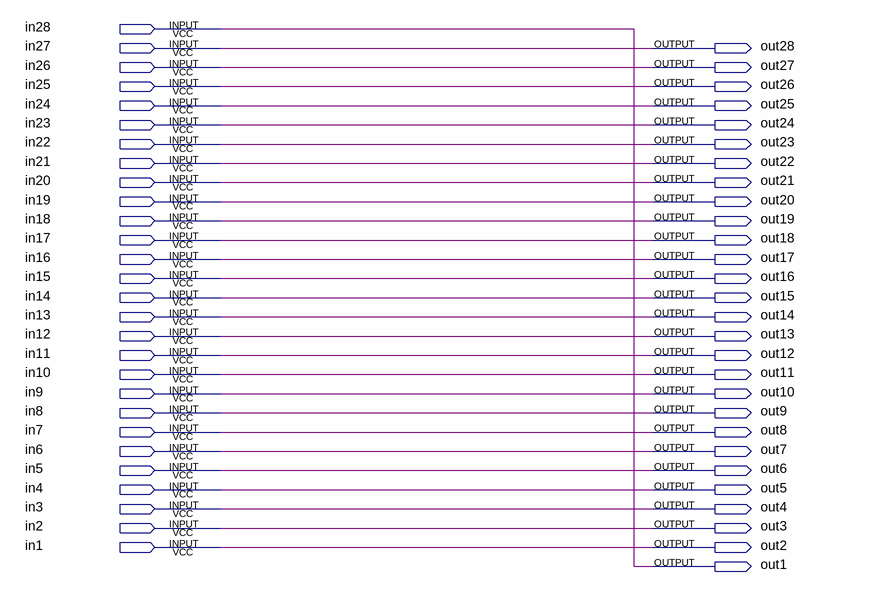
[diagram p0: schematic sheet]
// Quartus schematic lshift1.bdf as structural Verilog: 0 symbols, 56 pins
module lshift1 (
  input  in28,
  input  in27,
  input  in26,
  input  in25,
  input  in24,
  input  in23,
  input  in22,
  input  in21,
  input  in20,
  input  in19,
  input  in18,
  input  in17,
  input  in16,
  input  in15,
  input  in14,
  input  in13,
  input  in12,
  input  in11,
  input  in10,
  input  in9,
  input  in8,
  input  in7,
  input  in6,
  input  in5,
  input  in4,
  input  in3,
  input  in2,
  input  in1,
  output out28,
  output out27,
  output out26,
  output out25,
  output out24,
  output out23,
  output out22,
  output out21,
  output out20,
  output out19,
  output out18,
  output out17,
  output out16,
  output out15,
  output out14,
  output out13,
  output out12,
  output out11,
  output out10,
  output out9,
  output out8,
  output out7,
  output out6,
  output out5,
  output out4,
  output out3,
  output out2,
  output out1
);


  assign out1 = in28;
  assign out2 = in1;
  assign out3 = in2;
  assign out4 = in3;
  assign out5 = in4;
  assign out6 = in5;
  assign out7 = in6;
  assign out8 = in7;
  assign out9 = in8;
  assign out10 = in9;
  assign out11 = in10;
  assign out12 = in11;
  assign out13 = in12;
  assign out14 = in13;
  assign out15 = in14;
  assign out16 = in15;
  assign out17 = in16;
  assign out18 = in17;
  assign out19 = in18;
  assign out20 = in19;
  assign out21 = in20;
  assign out22 = in21;
  assign out23 = in22;
  assign out24 = in23;
  assign out25 = in24;
  assign out26 = in25;
  assign out27 = in26;
  assign out28 = in27;
endmodule
